# Altium schematic sheet Sheet1.SchDoc
size A2
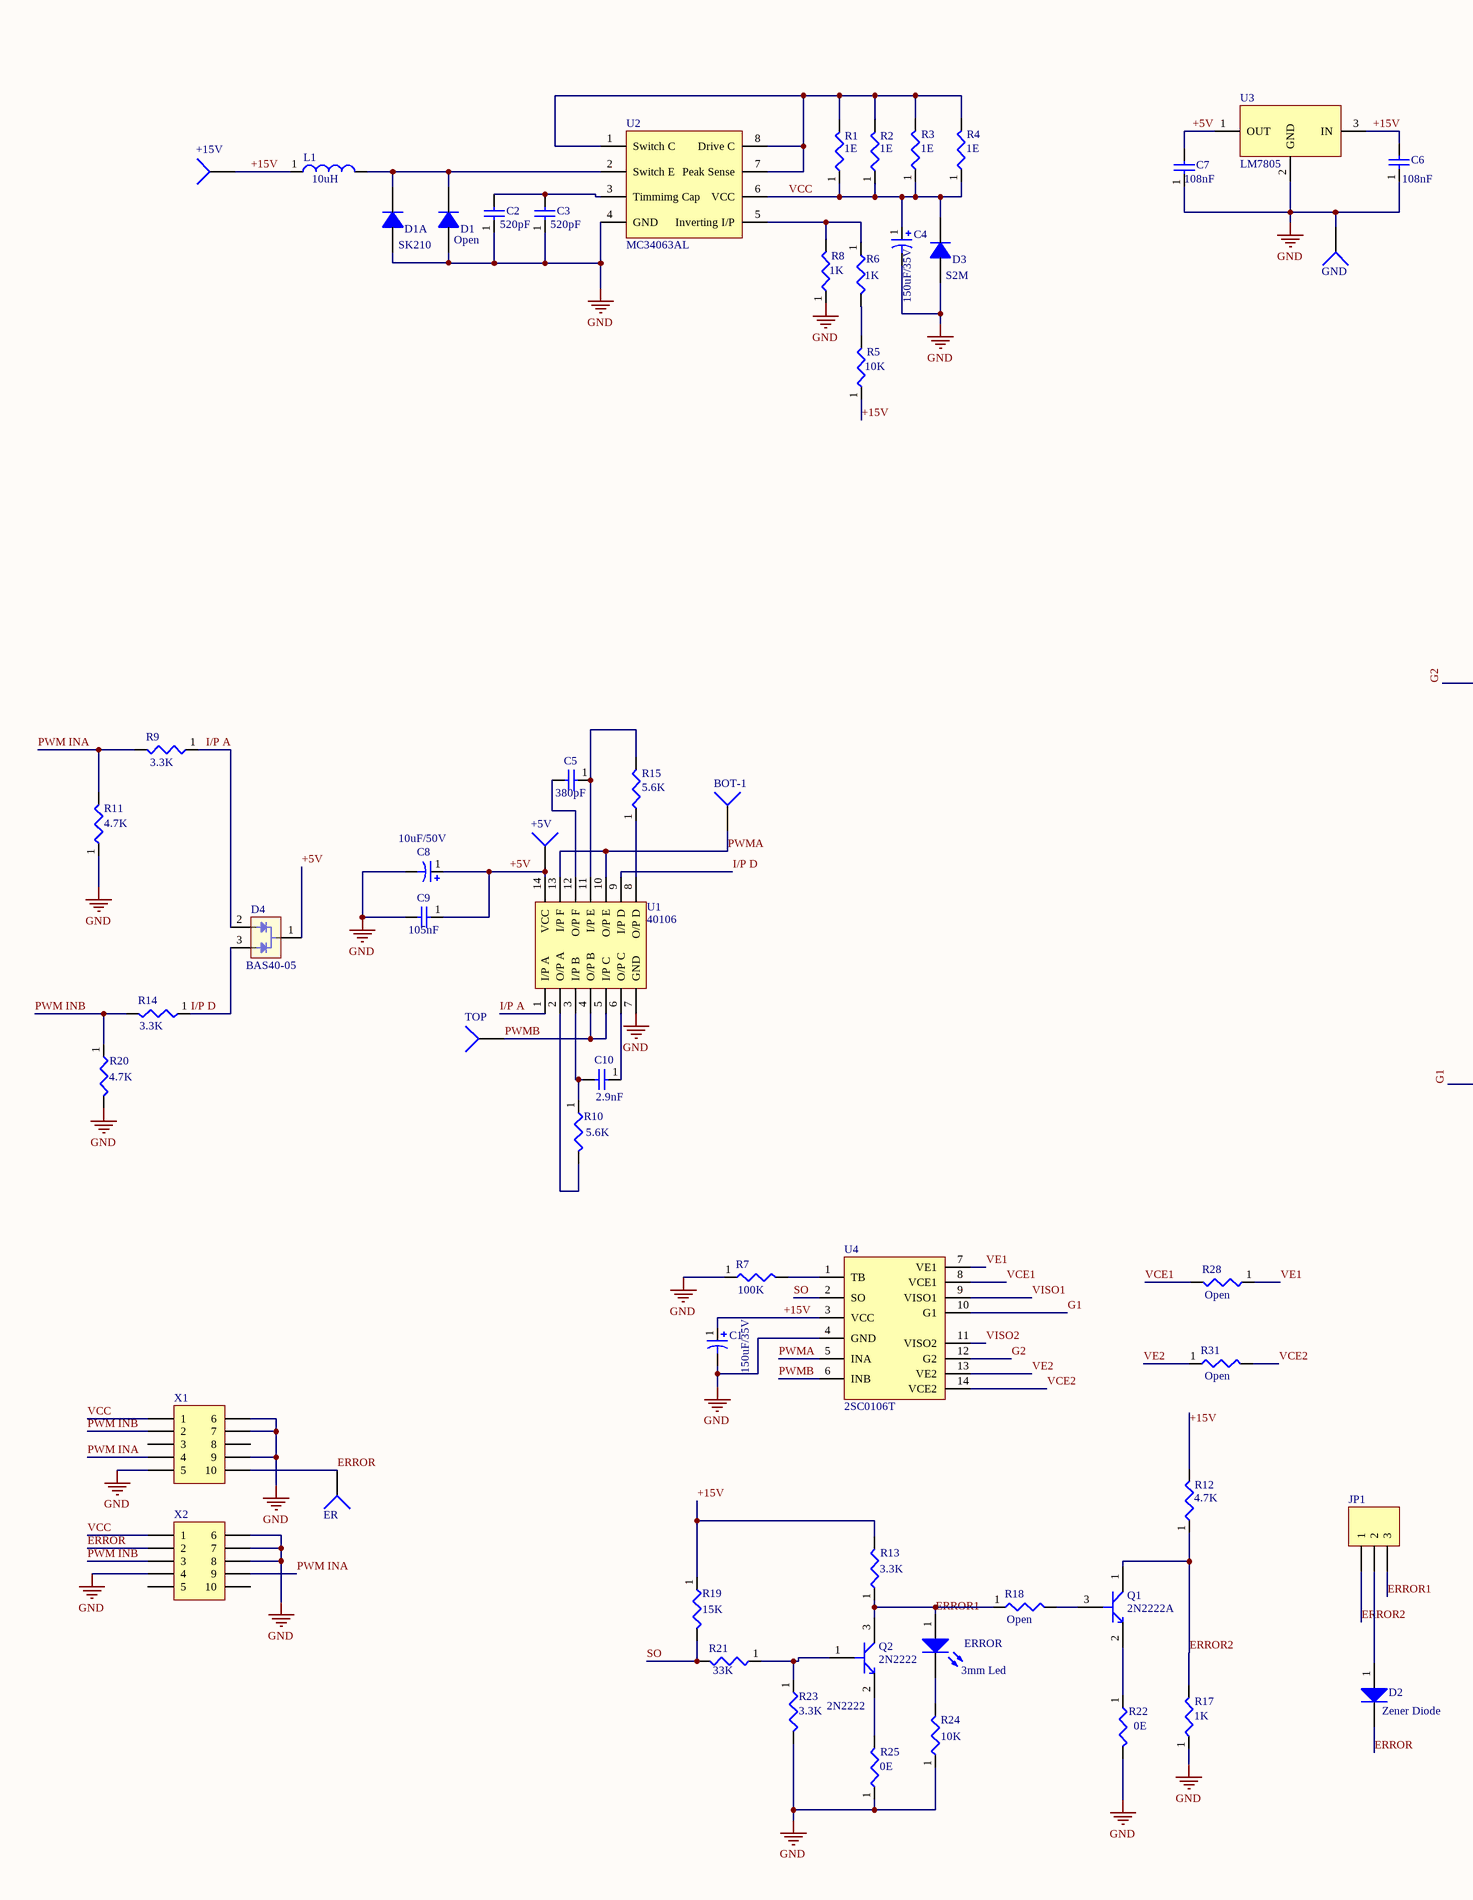
[diagram p0: Sheet1.SchDoc, left]
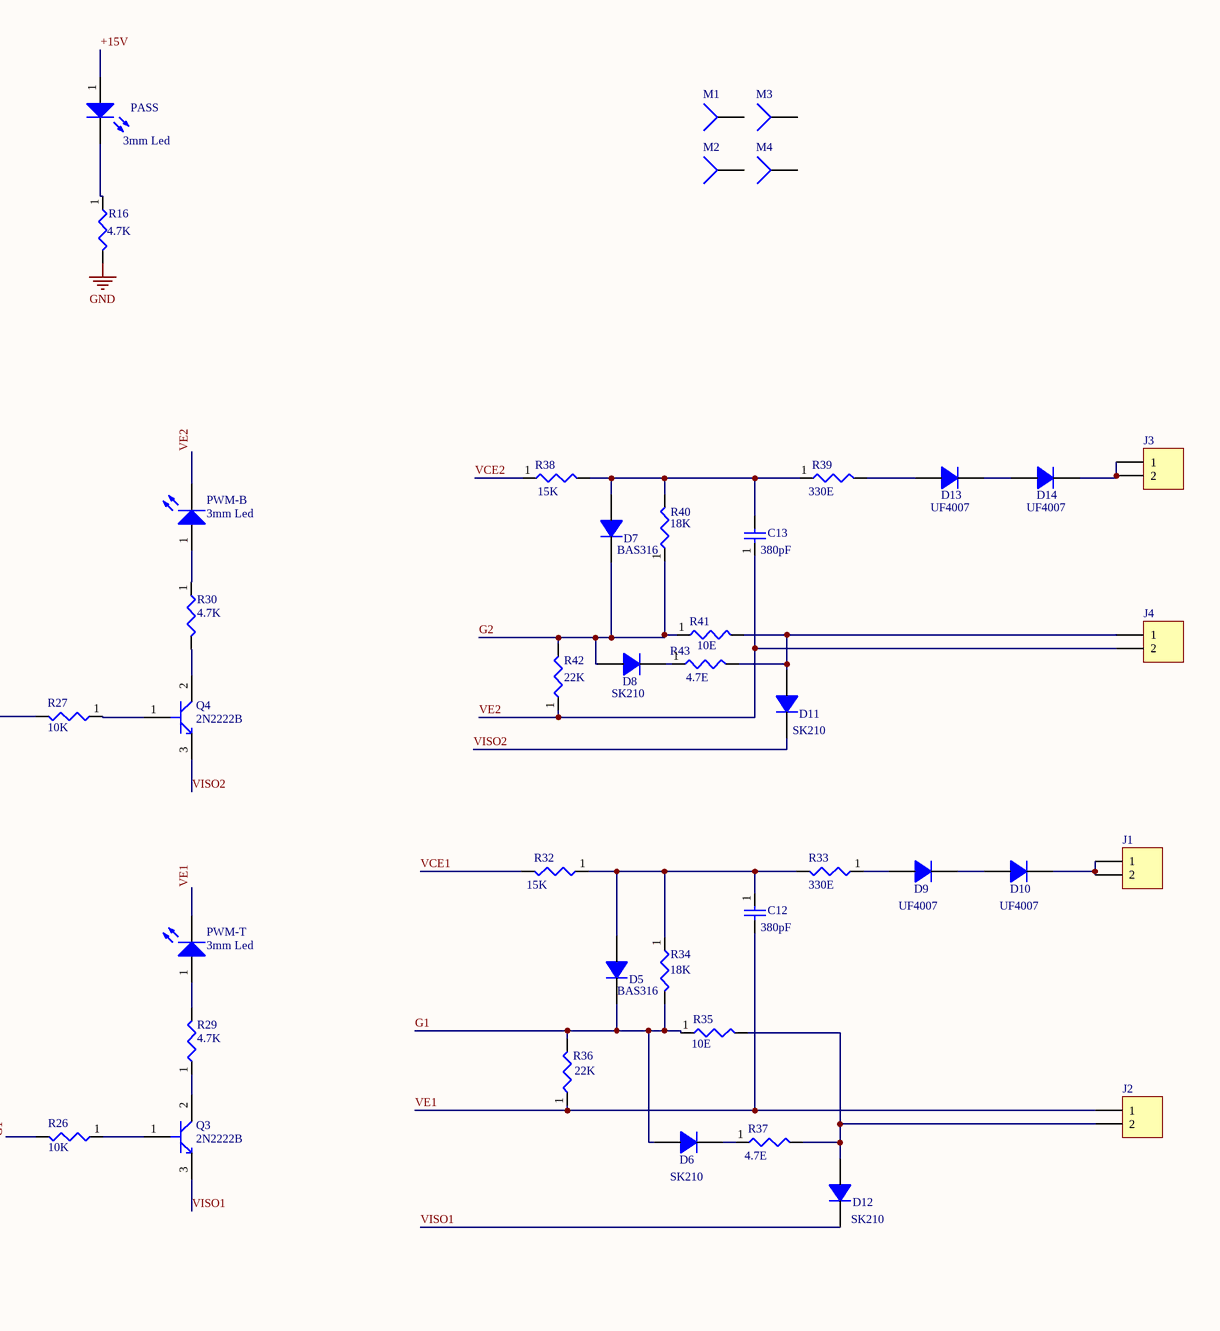
[diagram p1: Sheet1.SchDoc, right]

## Parts
+5V  Socket  [tp]  (value not drawn)
+15V  Socket  [tp]  (value not drawn)
BOT-1  Socket  [tp]  (value not drawn)
C1  value 150uF/35V  [10 mm Elco]  (hidden comment: Cap Pol1)
C2  value 520pF  [RESC0805-1206]  (hidden comment: Cap)
C3  value 520pF  [RESC0805-1206]  (hidden comment: Cap)
C4  value 150uF/35V  [10 mm Elco]  (hidden comment: Cap Pol1)
C5  value 380pF  [RESC0805-1206]  (hidden comment: Cap)
C6  value 108nF  [RESC0805-1206]  (hidden comment: Cap)
C7  value 108nF  [RESC0805-1206]  (hidden comment: Cap)
C8  value 10uF/50V  [elco cap]  (hidden comment: Cap Pol1)
C9  value 105nF  [RESC0805-1206]  (hidden comment: Cap)
C10  value 2.9nF  [RESC0805-1206]  (hidden comment: Cap)
C12  value 380pF  [RESC0805-1206]  (hidden comment: Cap)
C13  value 380pF  [RESC0805-1206]  (hidden comment: Cap)
D1  value Open  [Diode]  (hidden comment: Diode)
D1A  value SK210  [smb]  (hidden comment: Diode)
D2  value Zener Diode  [1206 diode]  (hidden comment: Diode)
D3  value S2M  [smb]  (hidden comment: Diode)
D4  BAS40-05  [SOT23_N]
D5  value BAS316  [smd diode]  (hidden comment: Diode)
D6  value SK210  [smb]  (hidden comment: Diode)
D7  value BAS316  [smd diode]  (hidden comment: Diode)
D8  value SK210  [smb]  (hidden comment: Diode)
D9  value UF4007  [Diode]  (hidden comment: Diode)
D10  value UF4007  [Diode]  (hidden comment: Diode)
D11  value SK210  [smb]  (hidden comment: Diode)
D12  value SK210  [smb]  (hidden comment: Diode)
D13  value UF4007  [Diode]  (hidden comment: Diode)
D14  value UF4007  [Diode]  (hidden comment: Diode)
ER  Socket  [tp]  (value not drawn)
ERROR  value 3mm Led  [led]  (hidden comment: LED0)
GND  Socket  [tp]  (value not drawn)
J1  Header 2  [2 pin con]  (value not drawn)
J2  Header 2  [2 pin con]  (value not drawn)
J3  Header 2  [2 pin con]  (value not drawn)
J4  Header 2  [2 pin con]  (value not drawn)
JP1  Header 3  [3 pin con]  (value not drawn)
L1  value 10uH  [INDUCTOR]  (hidden comment: Inductor)
M1  Socket  [Mounting Hole]  (value not drawn)
M2  Socket  [Mounting Hole]  (value not drawn)
M3  Socket  [Mounting Hole]  (value not drawn)
M4  Socket  [Mounting Hole]  (value not drawn)
PASS  value 3mm Led  [led]  (hidden comment: LED0)
PWM-B  value 3mm Led  [led]  (hidden comment: LED0)
PWM-T  value 3mm Led  [led]  (hidden comment: LED0)
Q1  2N2222A  [SOT23_N]
Q2  2N2222  [SOT-23_N]
Q3  2N2222B  [SOT-23_N]
Q4  2N2222B  [SOT-23_N]
R1  value 1E  [RESC0805-1206]  (hidden comment: Res3)
R2  value 1E  [RESC0805-1206]  (hidden comment: Res3)
R3  value 1E  [RESC0805-1206]  (hidden comment: Res3)
R4  value 1E  [RESC0805-1206]  (hidden comment: Res3)
R5  value 10K  [RESC0805-1206]  (hidden comment: Res3)
R6  value 1K  [RESC0805-1206]  (hidden comment: Res3)
R7  value 100K  [RESC0805-1206]  (hidden comment: Res3)
R8  value 1K  [RESC0805-1206]  (hidden comment: Res3)
R9  value 3.3K  [RESC0805-1206]  (hidden comment: Res3)
R10  value 5.6K  [RESC0805-1206]  (hidden comment: Res3)
R11  value 4.7K  [RESC0805-1206]  (hidden comment: Res3)
R12  value 4.7K  [RESC0805-1206]  (hidden comment: Res3)
R13  value 3.3K  [RESC0805-1206]  (hidden comment: Res3)
R14  value 3.3K  [RESC0805-1206]  (hidden comment: Res3)
R15  value 5.6K  [RESC0805-1206]  (hidden comment: Res3)
R16  value 4.7K  [RESC0805-1206]  (hidden comment: Res3)
R17  value 1K  [RESC0805-1206]  (hidden comment: Res3)
R18  value Open  [RESC0805-1206]  (hidden comment: Res3)
R19  value 15K  [RESC0805-1206]  (hidden comment: Res3)
R20  value 4.7K  [RESC0805-1206]  (hidden comment: Res3)
R21  value 33K  [RESC0805-1206]  (hidden comment: Res3)
R22  value 0E  [RESC0805-1206]  (hidden comment: Res3)
R23  value 3.3K  [RESC0805-1206]  (hidden comment: Res3)
R24  value 10K  [RESC0805-1206]  (hidden comment: Res3)
R25  value 0E  [RESC0805-1206]  (hidden comment: Res3)
R26  value 10K  [RESC0805-1206]  (hidden comment: Res3)
R27  value 10K  [RESC0805-1206]  (hidden comment: Res3)
R28  value Open  [RESC0805-1206]  (hidden comment: Res3)
R29  value 4.7K  [RESC0805-1206]  (hidden comment: Res3)
R30  value 4.7K  [RESC0805-1206]  (hidden comment: Res3)
R31  value Open  [RESC0805-1206]  (hidden comment: Res3)
R32  value 15K  [RESC0805-1206]  (hidden comment: Res3)
R33  value 330E  [RESC0805-1206]  (hidden comment: Res3)
R34  value 18K  [RESC0805-1206]  (hidden comment: Res3)
R35  value 10E  [2W Res]  (hidden comment: Res3)
R36  value 22K  [RESC0805-1206]  (hidden comment: Res3)
R37  value 4.7E  [2W Res]  (hidden comment: Res3)
R38  value 15K  [RESC0805-1206]  (hidden comment: Res3)
R39  value 330E  [RESC0805-1206]  (hidden comment: Res3)
R40  value 18K  [RESC0805-1206]  (hidden comment: Res3)
R41  value 10E  [2W Res]  (hidden comment: Res3)
R42  value 22K  [RESC0805-1206]  (hidden comment: Res3)
R43  value 4.7E  [2W Res]  (hidden comment: Res3)
TOP  Socket  [tp]  (value not drawn)
U1  value 40106  [sop14]  (hidden comment: CD40106)
U2  MC34063AL
U3  LM7805
U4  2SC0106T  [14 pin ic]
X1  Header 5X2A  [10 pin con]  (value not drawn)
X2  Header 5X2A  [X2 CON]  (value not drawn)

## Nets
GND: C1.2 C2.1 C3.1 C4.2 C6.1 C7.1 C8.2 C9.2 D1.2 D1A.2 D3.2 GND.1 R7.1 R8.1 R11.1 R16.2 R17.1 R20.2 R22.2 R23.2 R24.1 R25.1 U1.7(GND) U2.4(GND) U3.2(GND) U4.4(GND) X1.5 X1.6 X1.7 X1.9 X2.4 X2.6 X2.7 X2.8
+5V: +5V.1 C7.2 C8.1 C9.1 D4.1 U1.14(VCC) U3.1(OUT)
+15V: +15V.1 C1.1 C6.2 L1.1 PASS.1(A) R5.1 R12.2 R13.2 R19.1 U3.3(IN) U4.3(VCC)
ERROR: D2.2(K) ER.1 X1.10 X2.2
ERROR1: ERROR.1(A) JP1.3 Q2.3 R13.1 R18.1
ERROR2: JP1.1 Q1.1 R12.1 R17.2
G1: D5.1 D6.2 R26.2 R34.2 R35.1 R36.2 U4.10(G1)
G2: D7.1 D8.2 R27.2 R40.1 R41.1 R42.2 U4.12(G2)
I/P A: D4.2 R9.1 U1.1(I/P_A)
I/P D: D4.3 R14.1 U1.9(I/P_D)
PWM INA: R9.2 R11.2 X1.4 X2.9
PWM INB: R14.2 R20.1 X1.2 X2.3
PWMA: BOT-1.1 U1.10(O/P_E) U1.13(I/P_F) U4.5(INA)
PWMB: TOP.1 U1.4(O/P_B) U1.5(I/P_C) U4.6(INB)
SO: R19.2 R21.2 U4.2(SO)
VCC: C4.1 D3.1 R1.1 R2.1 R3.1 R4.1 U2.6(VCC) X1.1 X2.1
VCE1: R28.2 R32.2 U4.8(VCE1)
VCE2: R31.2 R38.1 U4.14(VCE2)
VE1: C12.2 J2.1 PWM-T.2(K) R28.1 R36.1 U4.7(VE1)
VE2: C13.1 J4.2 PWM-B.2(K) R31.1 R42.1 U4.13(VE2)
VISO1: D12.1 Q3.3 U4.9(VISO1)
VISO2: D11.1 Q4.3 U4.11(VISO2)
NetC2_2: C2.2 C3.2 U2.3(Timmimg_Cap)
NetC5_1: C5.1 R15.2 U1.11(I/P_E)
NetC5_2: C5.2 U1.12(O/P_F)
NetC10_1: C10.1 U1.6(O/P_C)
NetC10_2: C10.2 R10.1 U1.3(I/P_B)
NetC12_1: C12.1 D5.2 R32.1 R33.2 R34.1
NetC13_2: C13.2 D7.2 R38.2 R39.1 R40.2
NetD1_1: D1.1 D1A.1 L1.2 U2.2(Switch_E)
NetD2_1: D2.1(A) JP1.2
NetD6_1: D6.1 R37.1
NetD8_1: D8.1 R43.1
NetD9_1: D9.1 D10.2
NetD9_2: D9.2 R33.1
NetD10_1: D10.1 J1.1 J1.2
NetD11_2: D11.2 J4.1 R41.2 R43.2
NetD12_2: D12.2 J2.2 R35.2 R37.2
NetD13_1: D13.1 D14.2
NetD13_2: D13.2 R39.2
NetD14_1: D14.1 J3.1 J3.2
NetERROR_2: ERROR.2(K) R24.2
NetPASS_2: PASS.2(K) R16.1
NetPWM-B_1: PWM-B.1(A) R30.1
NetPWM-T_1: PWM-T.1(A) R29.2
NetQ1_2: Q1.2 R22.1
NetQ1_3: Q1.3 R18.2
NetQ2_1: Q2.1 R21.1 R23.1
NetQ2_2: Q2.2 R25.2
NetQ3_1: Q3.1 R26.1
NetQ3_2: Q3.2 R29.1
NetQ4_1: Q4.1 R27.1
NetQ4_2: Q4.2 R30.2
NetR1_2: R1.2 R2.2 R3.2 R4.2 U2.1(Switch_C) U2.7(Peak_Sense) U2.8(Drive_C)
NetR5_2: R5.2 R6.2
NetR6_1: R6.1 R8.2 U2.5(Inverting_I/P)
NetR7_2: R7.2 U4.1(TB)
NetR10_2: R10.2 U1.2(O/P_A)
NetR15_1: R15.1 U1.8(O/P_D)

Not connected (* = marked no-connect by the designer): M1 1; M2 1; M3 1; M4 1; X1 3 8; X2 5 10

## Library data of the parts
C1 C4 C8 = Cap Pol1: Polarized Capacitor (Radial); Published: 8-Jun-2000; LatestRevisionDate: 17-Jul-2002; LatestRevisionNote: Re-released for DXP Platform.; PackageReference: RB7.6-15; Publisher: Altium Limited; PackageDescription: Polarized Capacitor (Radial); 2 Leads
C2 C3 C5-C7 C9 C10 C12 C13 = Cap: Capacitor; Published: 8-Jun-2000; LatestRevisionDate: 17-Jul-2002; LatestRevisionNote: Re-released for DXP Platform.; PackageReference: RAD-0.3; Publisher: Altium Limited; PackageDescription: Radial Cap, Thru-Hole; 2 Leads; 0.3 in Pin Spacing
D2 = Diode: Default Diode; Published: 8-Jun-2000; LatestRevisionDate: 17-Jul-2002; LatestRevisionNote: Re-released for DXP Platform.; PackageVersion: Sep-1996; PackageReference: SMC; Publisher: Altium Limited; PackageDescription: DO-214-AB/SMC; 2 C-Bend Leads; Body 7.9 x 5.9 mm, inc. leads (LxW); Code_JEDEC: DO-214-AB
ERROR PASS PWM-B PWM-T = LED0: Typical INFRARED GaAs LED; Published: 8-Jun-2000; LatestRevisionDate: 08-Jul-2005; LatestRevisionNote: Mech Layer 1 removed.; PackageReference: LED-0; Publisher: Altium Limited; PackageDescription: LED; 2 Leads
J1-J4 = Header 2: Header, 2-Pin; LatestRevisionDate: 17-Jul-2002; LatestRevisionNote: Re-released for DXP Platform.; Publisher: Altium Limited
JP1 = Header 3: Header, 3-Pin; LatestRevisionDate: 17-Jul-2002; LatestRevisionNote: Re-released for DXP Platform.; Publisher: Altium Limited
L1 = Inductor: Code_IEC: 1005; Published: 8-Jun-2000; LatestRevisionDate: 29-May-2009; LatestRevisionNote: IPC-7351 Footprint Added.; PackageReference: 0402-A; Publisher: Altium Limited; PackageDescription: Chip Inductor; Code_JEITA: 0402
R1-R43 = Res3: Resistor; Published: 8-Jun-2000; LatestRevisionDate: 29-May-2009; LatestRevisionNote: IPC-7351 Footprint Added.; PackageReference: J1-0603; Publisher: Altium Limited; PackageDescription: Chip Resistor
X1 X2 = Header 5X2A: Header, 5-Pin, Dual row; LatestRevisionDate: 17-Jul-2002; LatestRevisionNote: Re-released for DXP Platform.; Publisher: Altium Limited
+5V +15V BOT-1 ER GND M1-M4 TOP = Socket: LatestRevisionDate: 17-Jul-2002; LatestRevisionNote: Re-released for DXP Platform.; Publisher: Altium Limited
D4 = BAS40-05: Value: BAS40-05
Q2 = 2N2222: Value: 2N2222
U2 = MC34063AL: Value: MC34063AL
U3 = LM7805: Value: LM7805
U4 = 2SC0106T: Value: 2SC0106T